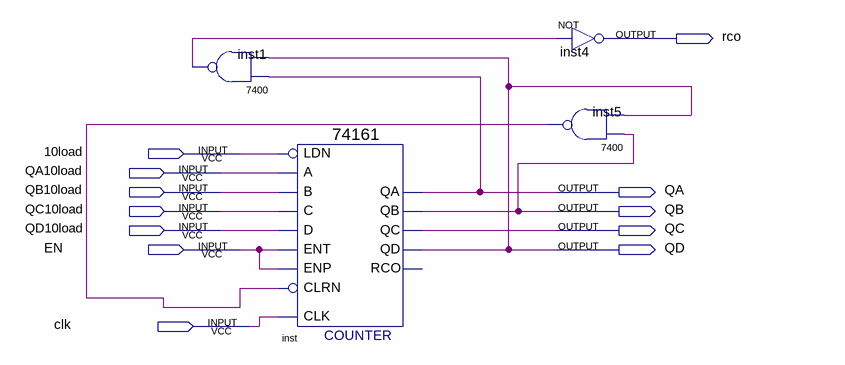
[diagram p0: schematic sheet]
// Quartus schematic mod10.bdf as structural Verilog: 4 symbols, 12 pins
module mod10 (
  input  \10load ,
  input  QA10load,
  input  QB10load,
  input  QC10load,
  input  QD10load,
  input  EN,
  input  clk,
  output rco,
  output QA,
  output QB,
  output QC,
  output QD
);

  wire inst1_1, inst5_1;

  \7400  inst1 (.\3 (QD), .\2 (QA), .\1 (inst1_1));
  \74161  inst (
    .CLRN(inst5_1), .CLK(clk), .ENP(EN), .LDN(\10load ), .A(QA10load), .D(QD10load), .ENT(EN), .B(QB10load),
    .C(QC10load), .QD(QD), .QC(QC), .QB(QB), .QA(QA));  // open: RCO
  not inst4 (rco, inst1_1);
  \7400  inst5 (.\3 (QD), .\2 (QB), .\1 (inst5_1));
endmodule
